# EAGLE design vfd (EAGLE 9.4.2)
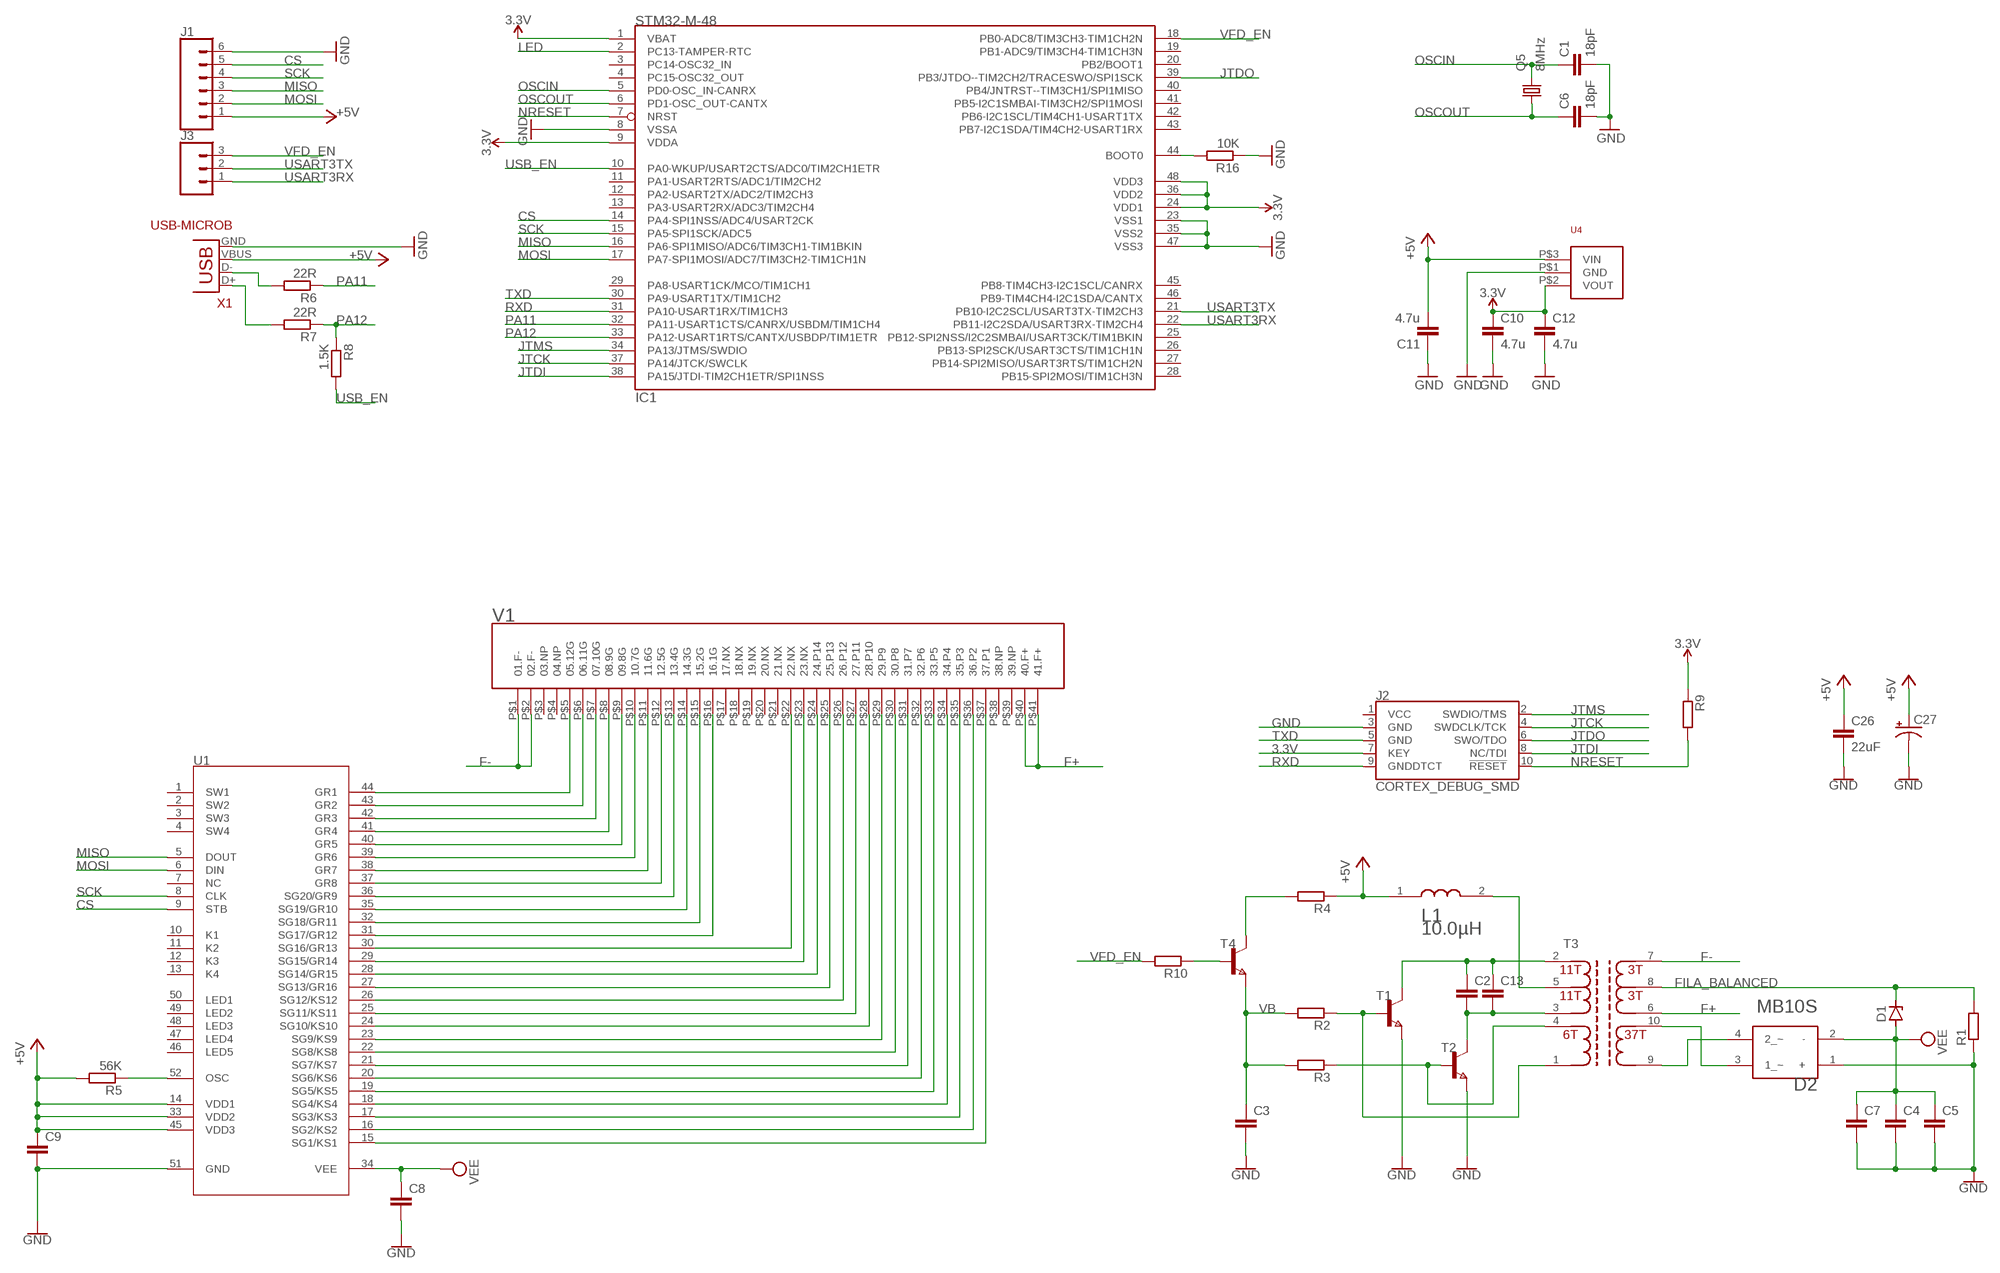
[diagram p0: schematic, sheet 1]

## Parts
C1  18pF  C-EUC0603  [C0603]
C2  C-EUC1206  [C1206]
C3  C-EUC0805  [C0805]
C4  C-EUC0805  [C0805]
C5  C-EUC0805  [C0805]
C6  18pF  C-EUC0603  [C0603]
C7  C-EUC0805  [C0805]
C8  C-EUC0805  [C0805]
C9  C-EUC0805  [C0805]
C10  4.7u  CAP0805  [0805]
C11  4.7u  CAP0805  [0805]
C12  4.7u  CAP0805  [0805]
C13  C-EUC1206  [C1206]
C26  22uF  C-EUC1206  [C1206]
C27  CPOL-US153CLV-0807  [153CLV-0807]
D1  ZENER-DIODESOD80C  [SOD80C]
D2  ON_SEMI_MB10SON_SEMI_MB10S_0_0  [ON_SEMI_MB10S_0]
IC1  STM32-M-48  [LQFP48]
J1  CONN_06NO_SILK_FEMALE_PTH  [1X06_NO_SILK]
J2  CORTEX_DEBUG_SMD  [SAMTECH_FTSH-105-01]
J3  CONN_031X03_NO_SILK  [1X03_NO_SILK]
L1  TDK_SLF7045T-100M1R3-PF  [ASWPA8050]
Q5  8MHz  KX-7  [3.2X2.5_KX-7]
R1  R-EU_R0603  [R0603]
R2  R-EU_R0603  [R0603]
R3  R-EU_R0603  [R0603]
R4  R-EU_R0603  [R0603]
R5  56K  R-EU_R0603  [R0603]
R6  22R  R-EU_R0603  [R0603]
R7  22R  R-EU_R0603  [R0603]
R8  1.5K  R-EU_R0603  [R0603]
R9  R-EU_R0603  [R0603]
R10  R-EU_R0603  [R0603]
R16  10K  R-EU_R0603  [R0603]
T1  NPNSOT23  [SOT-23]
T2  NPNSOT23  [SOT-23]
T3  TRANS_VFD_ER10P5  [ER10P5]
T4  NPNSOT23  [SOT-23]
U1  PT6311B  [QFP52_SOT379-1]
U4  MCP1703SOT-3.3V  MCP1703SOT  [SOT-23A]
V1  VFD_12SS62  [12SS62]
X1  USB-MICROB  [USB-MICROB]

## Nets
3.3V: C10.1 C12.1 IC1.1(VBAT) IC1.9(VDDA) IC1.24(VDD1) IC1.36(VDD2) IC1.48(VDD3) J2.7(KEY) R9.1 U4.P$2(VOUT)
+5V: C9.1 C11.2 C26.1 C27.+ J1.1 L1.1 R4.1 R5.2 U1.14(VDD1) U1.33(VDD2) U1.45(VDD3) U4.P$3(VIN) X1.VBUS
CS: IC1.14(PA4-SPI1NSS/ADC4/USART2CK) J1.5 U1.9(STB)
F+: T3.6 V1.P$40(40.F+) V1.P$41(41.F+)
F-: T3.7 V1.P$1(01.F-) V1.P$2(02.F-)
FILA_BALANCED: D1.C R1.2 T3.8
GND: C1.2 C3.2 C4.2 C5.2 C6.2 C7.2 C8.2 C9.2 C10.2 C11.1 C12.2 C26.2 C27.- D2.1(+) IC1.8(VSSA) IC1.23(VSS1) IC1.35(VSS2) IC1.47(VSS3) J1.6 J2.3(GND) R1.1 R16.1 T1.2(E) T2.2(E) U1.51(GND) U4.P$1(GND) X1.GND
JTCK: IC1.37(PA14/JTCK/SWCLK) J2.4(SWDCLK/TCK)
JTDI: IC1.38(PA15/JTDI-TIM2CH1ETR/SPI1NSS) J2.8(NC/TDI)
JTDO: IC1.39(PB3/JTDO--TIM2CH2/TRACESWO/SPI1SCK) J2.6(SWO/TDO)
JTMS: IC1.34(PA13/JTMS/SWDIO) J2.2(SWDIO/TMS)
LED: IC1.2(PC13-TAMPER-RTC)
MISO: IC1.16(PA6-SPI1MISO/ADC6/TIM3CH1-TIM1BKIN) J1.3 U1.5(DOUT)
MOSI: IC1.17(PA7-SPI1MOSI/ADC7/TIM3CH2-TIM1CH1N) J1.2 U1.6(DIN)
N$5: U1.44(GR1) V1.P$5(05.12G)
N$6: U1.43(GR2) V1.P$6(06.11G)
N$7: U1.42(GR3) V1.P$7(07.10G)
N$8: U1.41(GR4) V1.P$8(08.9G)
N$9: U1.40(GR5) V1.P$9(09.8G)
N$10: U1.39(GR6) V1.P$10(10.7G)
N$11: U1.38(GR7) V1.P$11(11.6G)
N$12: U1.37(GR8) V1.P$12(12.5G)
N$13: U1.36(SG20/GR9) V1.P$13(13.4G)
N$14: U1.35(SG19/GR10) V1.P$14(14.3G)
N$15: U1.32(SG18/GR11) V1.P$15(15.2G)
N$16: U1.31(SG17/GR12) V1.P$16(16.1G)
N$17: U1.15(SG1/KS1) V1.P$37(37.P1)
N$18: U1.16(SG2/KS2) V1.P$36(36.P2)
N$19: U1.17(SG3/KS3) V1.P$35(35.P3)
N$20: U1.18(SG4/KS4) V1.P$34(34.P4)
N$21: U1.19(SG5/KS5) V1.P$33(33.P5)
N$22: U1.20(SG6/KS6) V1.P$32(32.P6)
N$23: U1.21(SG7/KS7) V1.P$31(31.P7)
N$24: U1.22(SG8/KS8) V1.P$30(30.P8)
N$25: U1.23(SG9/KS9) V1.P$29(29.P9)
N$26: U1.24(SG10/KS10) V1.P$28(28.P10)
N$27: U1.25(SG11/KS11) V1.P$27(27.P11)
N$28: U1.26(SG12/KS12) V1.P$26(26.P12)
N$29: U1.27(SG13/GR16) V1.P$25(25.P13)
N$30: U1.28(SG14/GR15) V1.P$24(24.P14)
N$31: U1.29(SG15/GR14) V1.P$23(23.NX)
N$32: U1.30(SG16/GR13) V1.P$22(22.NX)
N$33: R6.2 X1.D-
N$34: R7.2 X1.D+
N$35: R4.2 T4.1(C)
N$36: R10.1 T4.3(B)
N$41: R5.1 U1.52(OSC)
N$43: D2.4(2_~) T3.9
N$44: D2.3(1_~) T3.10
N$46: L1.2 T3.5
N$48: C2.1 C13.1 T1.1(C) T3.2
N$49: C2.2 C13.2 T2.1(C) T3.3
N$52: R3.1 T2.3(B) T3.4
N$53: R2.1 T1.3(B) T3.1
N$273: IC1.44(BOOT0) R16.2
NRESET: IC1.7(NRST) J2.10(!RESET) R9.2
OSCIN: C1.1 IC1.5(PD0-OSC_IN-CANRX) Q5.3
OSCOUT: C6.1 IC1.6(PD1-OSC_OUT-CANTX) Q5.1
PA11: IC1.32(PA11-USART1CTS/CANRX/USBDM/TIM1CH4) R6.1
PA12: IC1.33(PA12-USART1RTS/CANTX/USBDP/TIM1ETR) R7.1 R8.1
RXD: IC1.31(PA10-USART1RX/TIM1CH3) J2.9(GNDDTCT)
SCK: IC1.15(PA5-SPI1SCK/ADC5) J1.4 U1.8(CLK)
TXD: IC1.30(PA9-USART1TX/TIM1CH2) J2.5(GND)
USART3RX: IC1.22(PB11-I2C2SDA/USART3RX-TIM2CH4) J3.1
USART3TX: IC1.21(PB10-I2C2SCL/USART3TX-TIM2CH3) J3.2
USB_EN: IC1.10(PA0-WKUP/USART2CTS/ADC0/TIM2CH1ETR) R8.2
VB: C3.1 R2.2 R3.2 T4.2(E)
VEE: C4.1 C5.1 C7.1 C8.1 D1.A D2.2(-) U1.34(VEE)
VFD_EN: IC1.18(PB0-ADC8/TIM3CH3-TIM1CH2N) J3.3 R10.2
Unconnected: IC1.3(PC14-OSC32_IN) IC1.4(PC15-OSC32_OUT) IC1.11(PA1-USART2RTS/ADC1/TIM2CH2) IC1.12(PA2-USART2TX/ADC2/TIM2CH3) IC1.13(PA3-USART2RX/ADC3/TIM2CH4) IC1.19(PB1-ADC9/TIM3CH4-TIM1CH3N) IC1.20(PB2/BOOT1) IC1.25(PB12-SPI2NSS/I2C2SMBAI/USART3CK/TIM1BKIN) IC1.26(PB13-SPI2SCK/USART3CTS/TIM1CH1N) IC1.27(PB14-SPI2MISO/USART3RTS/TIM1CH2N) IC1.28(PB15-SPI2MOSI/TIM1CH3N) IC1.29(PA8-USART1CK/MCO/TIM1CH1) IC1.40(PB4/JNTRST--TIM3CH1/SPI1MISO) IC1.41(PB5-I2C1SMBAI-TIM3CH2/SPI1MOSI) IC1.42(PB6-I2C1SCL/TIM4CH1-USART1TX) IC1.43(PB7-I2C1SDA/TIM4CH2-USART1RX) IC1.45(PB8-TIM4CH3-I2C1SCL/CANRX) IC1.46(PB9-TIM4CH4-I2C1SDA/CANTX) J2.1(VCC) U1.1(SW1) U1.2(SW2) U1.3(SW3) U1.4(SW4) U1.7(NC) U1.10(K1) U1.11(K2) U1.12(K3) U1.13(K4) U1.46(LED5) U1.47(LED4) U1.48(LED3) U1.49(LED2) U1.50(LED1) V1.P$3(03.NP) V1.P$4(04.NP) V1.P$17(17.NX) V1.P$18(18.NX) V1.P$19(19.NX) V1.P$20(20.NX) V1.P$21(21.NX) V1.P$38(38.NP) V1.P$39(39.NP)

## Library data of the parts
C1 C6 = resistor:C-EU: CAPACITOR, European symbol
C2-C5 C7-C9 C13 = rcl:C-EU: CAPACITOR, European symbol; SPICEPREFIX: C
C10-C12 = SparkFun:CAP: Capacitor Standard 0603 ceramic capacitor, and 0.1" leaded capacitor.
C26 = resistor:C-EU: CAPACITOR, European symbol; HEIGHT: 1.8
C27 = rcl:CPOL-US: POLARIZED CAPACITOR, American symbol; SPICEPREFIX: C
D1 = diode:ZENER-DIODE: Z-Diode
D2 = ON Semi - MB10S:ON_SEMI_MB10S: Diode Rectifier Bridge Single 1KV 0.8A 4-Pin SOIC T/R; CENTROID_NOT_SPECIFIED: No; DATASHEET: http://www.onsemi.com/pub/Collateral/MB10S-D.pdf; DEVICE_CLASS_L1: Discrete Semiconductors; DEVICE_CLASS_L2: Diodes; DEVICE_CLASS_L3: Rectifier Diodes; DIGIKEY_DESCRIPTION: DIODE BRIDGE 0.5A 1000V 4-SOIC; DIGIKEY_PART_NUMBER: MB10SCT-ND; FOOTPRINT_URL: http://www.onsemi.com/pub/Collateral/751EP.PDF; FORWARD_CURRENT: 0.8A; HEIGHT: 2.9mm; LEAD_FREE: yes; MAX_JUNCTION_TEMP: +150°C; MAX_REPETITIVE_REVERSE_VOLTAGE: 1000V; MAX_SURGE_FORWARD_CURRENT: 35A; MF: ON Semi; MFG_PACKAGE_IDENT: 751EP; MFG_PACKAGE_IDENT_DATE: 09/2016; MFG_PACKAGE_IDENT_REV: O; MOUSER_PART_NUMBER: 512-MB10S; MPN: MB10S; PACKAGE: SOIC4; PEAK_REVERSE_CURRENT: 0.5mA; PREFIX: D; REVERSE_VOLTAGE: 1000V; ROHS: yes; STANDOFF_HEIGHT: 0.05mm; TEMPERATURE_RANGE_HIGH: +150°C; TEMPERATURE_RANGE_LOW: -55°C; VERIFICATION_VERSION: 0.0.0.1
IC1 = pel_stm32:STM32-M-48: STM32F103 Medium Density 48pins
J1 = SparkFun-Connectors:CONN_06: Multi connection point. Often used as Generic Header-pin footprint for 0.1 inch spaced/style header connections On any of the 0.1 inch spaced packages, you can populate with these: Break Away Headers - Straight <https://www.sparkfun.com/products/116> (PRT-00116) Break Away Male Headers - Right Angle <https://www.sparkfun.com/products/553> (PRT-00553) Female Headers <https://www.sparkfun.com/products/115> (PRT-00115) Break Away Headers - Machine Pin <https://www.sparkfun.com/products/117> (PRT-00117) Break Away Female Headers - Swiss Machine Pin <https://www.sparkfun.com/products/743> (PRT-00743) Arduino Stackable Header - 6 Pin <https://www.sparkfun.com/products/9280> (PRT-09280) For SCREWTERMINALS and SPRING TERMINALS visit here: Screw Terimnals on SparkFun.com <https://www.sparkfun.com/search/results?term=Screw+Terminals> (5mm/3.5mm/2.54mm spacing) This device is also useful as a general connection point to wire up your design to another part of your project. Our various solder wires solder well into these plated through hole pads. Hook-Up Wire - Assortment (Stranded, 22 AWG) <https://www.sparkfun.com/products/11375> (PRT-11375) Hook-Up Wire - Assortment (Solid Core, 22 AWG) <https://www.sparkfun.com/products/11367> (PRT-11367) View the entire wire category on our website here <https://www.sparkfun.com/categories/141>; PROD_ID: CONN-08437
J2 = SparkFun-Connectors:CORTEX_DEBUG: Cortex Debug Connector - 10 pin Supports JTAG debug, Serial Wire debug, and Serial Wire Viewer. PTH and SMD connector options available. General Connector Information <http://infocenter.arm.com/help/topic/com.arm.doc.faqs/attached/13634/cortex_debug_connectors.pdf> Products: PTH Connector <http://www.digikey.com/product-detail/en/cnc-tech/3220-10-0100-00/1175-1627-ND/3883661> -via Digi-Key SparkFun PSoc <https://www.sparkfun.com/products/13229> SparkFun T <https://www.sparkfun.com/products/13810>
J3 = SparkFun-Connectors:CONN_03: Multi connection point. Often used as Generic Header-pin footprint for 0.1 inch spaced/style header connections On any of the 0.1 inch spaced packages, you can populate with these: Break Away Headers - Straight <https://www.sparkfun.com/products/116> (PRT-00116) Break Away Male Headers - Right Angle <https://www.sparkfun.com/products/553> (PRT-00553) Female Headers <https://www.sparkfun.com/products/115> (PRT-00115) Break Away Headers - Machine Pin <https://www.sparkfun.com/products/117> (PRT-00117) Break Away Female Headers - Swiss Machine Pin <https://www.sparkfun.com/products/743> (PRT-00743) Stackable Header - 3 Pin (Female, 0.1") <https://www.sparkfun.com/products/13875> (PRT-13875) For SCREWTERMINALS and SPRING TERMINALS visit here: Screw Terimnals on SparkFun.com <https://www.sparkfun.com/search/results?term=Screw+Terminals> (5mm/3.5mm/2.54mm spacing) This device is also useful as a general connection point to wire up your design to another part of your project. Our various solder wires solder well into these plated through hole pads. Hook-Up Wire - Assortment (Stranded, 22 AWG) <https://www.sparkfun.com/products/11375> (PRT-11375) Hook-Up Wire - Assortment (Solid Core, 22 AWG) <https://www.sparkfun.com/products/11367> (PRT-11367) View the entire wire category on our website here <https://www.sparkfun.com/categories/141> Special notes: Molex polarized connector foot print use with SKU : PRT-08232 with associated crimp pins and housings.
L1 = TDK - SLF7045T-100M1R3-PF:TDK_SLF7045T-100M1R3-PF: FIXED IND 10UH 1.3A 43.2 MOHM
Q5 = crystal-geyer_V1_0:KX: Quartz Crystals (MHz) SMD: KX - Serie Model Size l/w/h [mm] Frequency Range Frequency Stability Temp. Range [°C] Load Capacitance AECQ 200 availabel Datasheet KX-4 KX-5 KX-6 KX-7 KX-9A KX-9B KX-12A KX-12B KX-13 KX-20 KX-K KX-KS 1.6/1.2/0.3 2.0/1.6/0.45 2.5/2.0/0.55 3.2/2.5/0.8 5.0/3.2/1.0 5.0/3.2/1.1 6.0/3.5/1.1 6.0/3.5/1.0 7.0/5.0 /1.3 11.6/5.5/1.6 12.3/4.5/4.2 12.3/4.5/3.2 24.0 ~ 80.0 MHz 16.0 ~ 80.0 MHz 12.0 ~ 80.0 MHz 8.0 ~ 60.0 MHz 7,68 ~ 300,0 MHz 8,0 ~ 50,0 MHz 8,0 ~ 150,0 MHz 8,0 ~ 50,0 MHz 6,0 ~ 160,0 MHz 3,579 ~ 25,0 MHz 3,579 ~ 70,0 MHz 3,579 ~ 70,0 MHz ±10 … ±50ppm ±10 … ±50ppm ±10 … ±50ppm ±10 … ±50ppm ±10 … ±50ppm ±10 … ±50ppm ±10 … ±50ppm ±10 … ±50ppm ±10 … ±50ppm ±50ppm ±10 … ±50ppm ±10 … ±50ppm (*) -40°C …+85°C (*) -40°C …+125°C (*) -40°C …+125°C (*) -40°C …+125°C (*) -40°C …+105°C (*) -40°C …+105°C (*) -40°C …+125°C (*) -40°C …+105°C (*) -40°C …+105°C (*) -40°C …+105°C (*) -40°C …+85°C (*) -40°C …+85°C 8, 8…16 8, 8…16 10, 8…16 12, 7…20 16, 10…20 16, 10…20 16, 10…20 16, 12…20 16, 12…20 16, 12…20 16, 12…30 16, 12…30 - yes yes yes - - - - - - - - KX-4.pdf <http://www.geyer-electronic.de/uploads/tx_userartikelfrequenz/GEYER-KX-4.pdf> KX-5.pdf <http://www.geyer-electronic.de/uploads/tx_userartikelfrequenz/GEYER-KX-5.pdf> KX-6.pdf <http://www.geyer-electronic.de/uploads/tx_userartikelfrequenz/GEYER-KX-6.pdf> KX-7.pdf <http://www.geyer-electronic.de/uploads/tx_userartikelfrequenz/GEYER-KX-7.pdf> KX-9A.pdf <http://www.geyer-electronic.de/uploads/tx_userartikelfrequenz/GEYER-KX-9A.pdf> KX-9B.pdf <http://www.geyer-electronic.de/uploads/tx_userartikelfrequenz/GEYER-KX-9B.pdf> KX-12A.pdf <http://www.geyer-electronic.de/uploads/tx_userartikelfrequenz/GEYER-KX-12A.pdf> KX-12B.pdf <http://www.geyer-electronic.de/uploads/tx_userartikelfrequenz/GEYER-KX-12B.pdf> KX-13.pdf <http://www.geyer-electronic.de/uploads/tx_userartikelfrequenz/GEYER-KX-13.pdf> KX-20.pdf <http://www.geyer-electronic.de/uploads/tx_userartikelfrequenz/GEYER-KX-20.pdf> KX-K.pdf <http://www.geyer-electronic.de/uploads/tx_userartikelfrequenz/GEYER-KX-K.pdf> KX-KS.pdf <http://www.geyer-electronic.de/uploads/tx_userartikelfrequenz/GEYER-KX-KS.pdf> <http://www.geyer-electronic.de/fileadmin/template/img/logo-geyer-electronic.png> Details see: http://www.geyer-electronic.de/Frequenz-Produkte.9.0.html Created 2016-06-07, Hans Locher 2016 (C) Geyer Quartz Technology KX4,KX5,KX6,KX7,KX9A,KX9B,KX12A,KX12B,KX13,KX20,KXK,KXKS;1612;2016;2520;3225;5032;6035;7050;11655;12345;1,6x1,2;2,0x1,6;2,5x2,0;3,2x2,5;5,0x3,2;6,0x3,5;7,0x5,0;11,6x5,5;12,3x4,5;12,3x4,5;1.6x1.2;2.0x1.6;2.5x2.0;3.2x2.5;5.0x3.2;6.0x3.5;7.0x5.0;11.6x5.5;12.3x4.5;12.3x4.5;
R1-R5 R9 R10 = rcl:R-EU_: RESISTOR, European symbol; SPICEPREFIX: R
R6-R8 R16 = resistor:R-EU_: RESISTOR, European symbol
T1 T2 T4 = zetex:NPNSOT23: NPN TRANSISTOR; MPN: DSS20201L-7; OC_FARNELL: 1710688; OC_NEWARK: 25R4555
T3 = vfd:TRANS_VFD_ER10P5
U1 = vfd:PT6311B
U4 = icedrink:MCP1703
V1 = vfd:VFD_12SS62
X1 = icedrink:USB: USB Connectors USB-B-PTH is fully proven SKU : PRT-00139 USB-miniB is fully proven SKU : PRT-00587 USB-A-PCB is untested. USB-A-H is throughly reviewed, but untested. Spark Fun Electronics SKU : PRT-00437 USB-B-SMT is throughly reviewed, but untested. Needs silkscreen touching up. USB-A-S has not been used/tested USB-MB-H has not been used/tested

## Net classes
0 default: clearance 0.205 mm

## Board
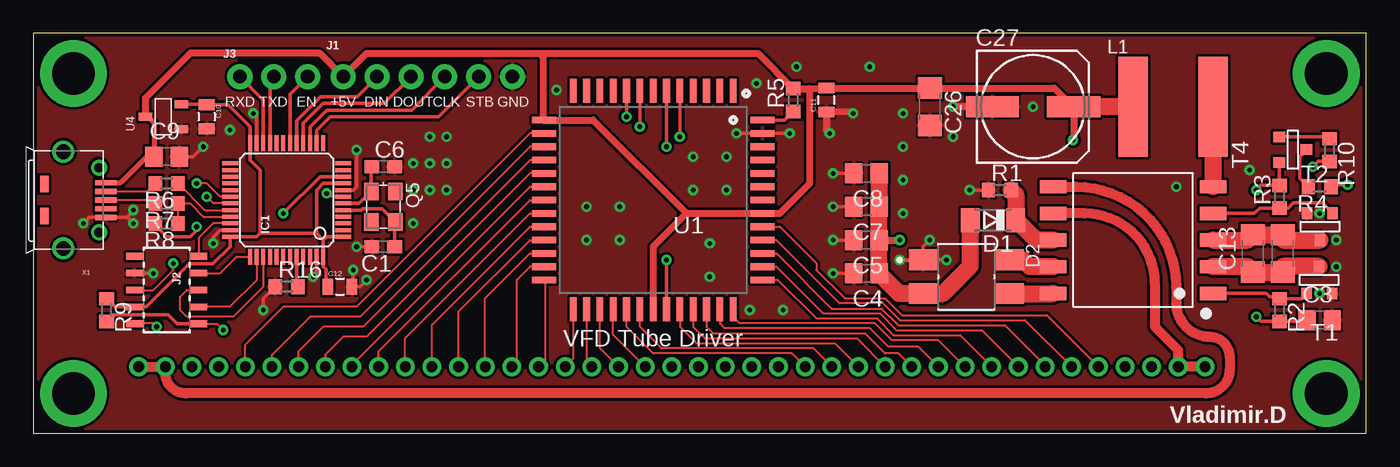
[diagram p1: board, top side]
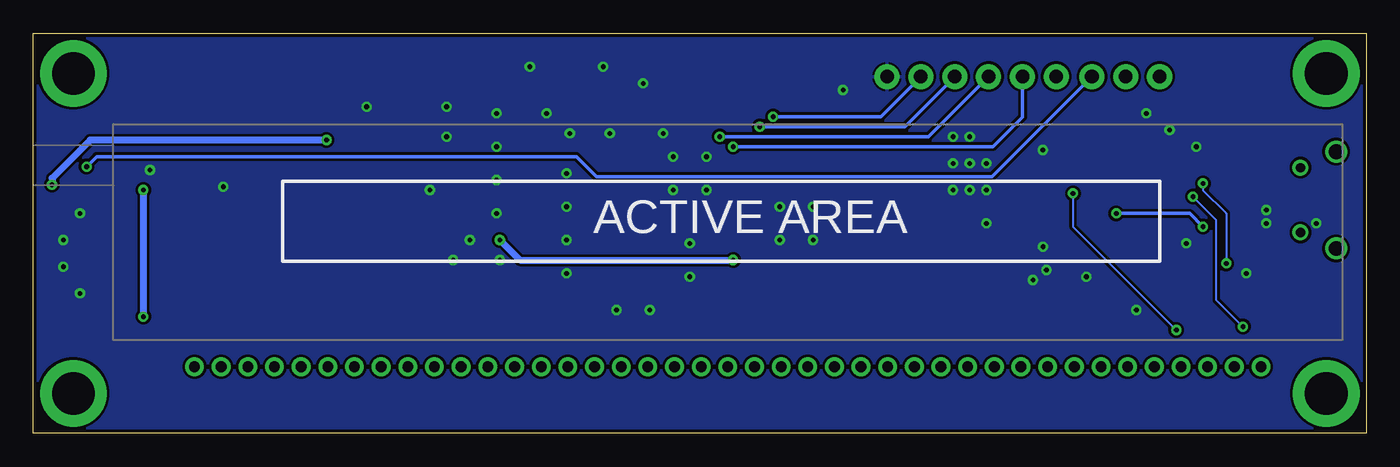
[diagram p2: board, bottom side, seen from below]

Size 100 x 30 mm. Coordinates in mm from the lower left corner, seen from the top.
Outline: 0,0 100,0 100,30 0,30 0,0
Copper layers (1*16): Top 0.035mm / dielectric 1.5mm / Bottom 0.035mm
Design rules "default *": minimum track width 6mil, minimum drill 0.35mm, track to track 5mil, track to pad 5mil, pad to pad 5mil, via to via 5mil, smd to smd 5mil, copper to edge 10mil, drill to drill 6mil, minimum pad ring 10mil, minimum via ring 8mil, stop-mask expansion 4mil, vias tented up to drill 40mil, thermal gap 6mil

### Footprints (pad centres in the part's own frame; a part is rotated, then mirrored left to right if it is on the bottom)
C0603 = smd 1.1 x 1: 1 -0.85,0; 2 0.85,0
C1206 = smd 1.6 x 1.8: 1 -1.4,0; 2 1.4,0
C0805 = smd 1.3 x 1.5: 1 -0.95,0; 2 0.95,0
0805 = smd 0.8 x 1.2: 1 -0.9,0; 2 0.9,0
153CLV-0807 = smd 4 x 1.6: + 3.05,0; - -3.05,0
SOD80C = smd 1.4 x 1.8: A 1.7,0; C -1.7,0
ON_SEMI_MB10S_0 = smd 1.55 x 2.1: 1 -1.27,-3.25; 2 1.27,-3.25; 3 1.27,3.25; 4 -1.27,3.25
LQFP48 = smd 0.3 x 1.2: 1 -2.75,-4.25; 2 -2.25,-4.25; 3 -1.75,-4.25; 4 -1.25,-4.25; 5 -0.75,-4.25; 6 -0.25,-4.25; 7 0.25,-4.25; 8 0.75,-4.25; 9 1.25,-4.25; 10 1.75,-4.25; 11 2.25,-4.25; 12 2.75,-4.25; 25 2.75,4.25; 26 2.25,4.25; 27 1.75,4.25; 28 1.25,4.25; 29 0.75,4.25; 30 0.25,4.25; 31 -0.25,4.25; 32 -0.75,4.25; 33 -1.25,4.25; 34 -1.75,4.25; 35 -2.25,4.25; 36 -2.75,4.25 | smd 1.2 x 0.3: 13 4.25,-2.75; 14 4.25,-2.25; 15 4.25,-1.75; 16 4.25,-1.25; 17 4.25,-0.75; 18 4.25,-0.25; 19 4.25,0.25; 20 4.25,0.75; 21 4.25,1.25; 22 4.25,1.75; 23 4.25,2.25; 24 4.25,2.75; 37 -4.25,2.75; 38 -4.25,2.25; 39 -4.25,1.75; 40 -4.25,1.25; 41 -4.25,0.75; 42 -4.25,0.25; 43 -4.25,-0.25; 44 -4.25,-0.75; 45 -4.25,-1.25; 46 -4.25,-1.75; 47 -4.25,-2.25; 48 -4.25,-2.75
1X06_NO_SILK = drill 1.016 pad 1.88: 1 0,0; 2 2.54,0; 3 5.08,0; 4 7.62,0; 5 10.16,0; 6 12.7,0
SAMTECH_FTSH-105-01 = smd 0.508 x 1.27: 1 -2.54,-2.413; 2 -2.54,2.413; 3 -1.27,-2.413; 4 -1.27,2.413; 5 0,-2.413; 6 0,2.413; 7 1.27,-2.413; 8 1.27,2.413; 9 2.54,-2.413; 10 2.54,2.413
1X03_NO_SILK = drill 1.016 pad 1.88: 1 0,0; 2 2.54,0; 3 5.08,0
ASWPA8050 = smd 2.2 x 7.5: 1 -3,0; 2 3,0
3.2X2.5_KX-7 = smd 1.3 x 1.1: 1 -1.15,-0.9; 2 1.15,-0.9; 3 1.15,0.9; 4 -1.15,0.9
R0603 = smd 1 x 1.1: 1 -0.85,0; 2 0.85,0
SOT-23 = smd 0.787 x 0.889: 1 0.025,-1.016; 2 -0.94,1.016; 3 0.991,1.016
ER10P5 = smd 1 x 2: 1 1,-1.5; 2 3,-1.5; 3 5,-1.5; 4 7,-1.5; 5 9,-1.5; 6 9,10.5; 7 7,10.5; 8 5,10.5; 9 3,10.5; 10 1,10.5
QFP52_SOT379-1 = smd 0.5 x 1.8: 1 -6,-8.2; 2 -5,-8.2; 3 -4,-8.2; 4 -3,-8.2; 5 -2,-8.2; 6 -1,-8.2; 7 0,-8.2; 8 1,-8.2; 9 2,-8.2; 10 3,-8.2; 11 4,-8.2; 12 5,-8.2; 13 6,-8.2; 27 6,8.2; 28 5,8.2; 29 4,8.2; 30 3,8.2; 31 2,8.2; 32 1,8.2; 33 0,8.2; 34 -1,8.2; 35 -2,8.2; 36 -3,8.2; 37 -4,8.2; 38 -5,8.2; 39 -6,8.2 | smd 1.8 x 0.5: 14 8.2,-6; 15 8.2,-5; 16 8.2,-4; 17 8.2,-3; 18 8.2,-2; 19 8.2,-1; 20 8.2,0; 21 8.2,1; 22 8.2,2; 23 8.2,3; 24 8.2,4; 25 8.2,5; 26 8.2,6; 40 -8.2,6; 41 -8.2,5; 42 -8.2,4; 43 -8.2,3; 44 -8.2,2; 45 -8.2,1; 46 -8.2,0; 47 -8.2,-1; 48 -8.2,-2; 49 -8.2,-3; 50 -8.2,-4; 51 -8.2,-5; 52 -8.2,-6
SOT-23A = smd 0.6 x 1: P$1 -0.95,-1.35; P$2 0.95,-1.35; P$3 0,1.35
12SS62 = drill 0.8 pad 1.4: P$1 6.1,-2; P$2 8.1,-2; P$3 10.1,-2; P$4 12.1,-2; P$5 14.1,-2; P$6 16.1,-2; P$7 18.1,-2; P$8 20.1,-2; P$9 22.1,-2; P$10 24.1,-2; P$11 26.1,-2; P$12 28.1,-2; P$13 30.1,-2; P$14 32.1,-2; P$15 34.1,-2; P$16 36.1,-2; P$17 38.1,-2; P$18 40.1,-2; P$19 42.1,-2; P$20 44.1,-2; P$21 46.1,-2; P$22 48.1,-2; P$23 50.1,-2; P$24 52.1,-2; P$25 54.1,-2; P$26 56.1,-2; P$27 58.1,-2; P$28 60.1,-2; P$29 62.1,-2; P$30 64.1,-2; P$31 66.1,-2; P$32 68.1,-2; P$33 70.1,-2; P$34 72.1,-2; P$35 74.1,-2; P$36 76.1,-2; P$37 78.1,-2; P$38 80.1,-2; P$39 82.1,-2; P$40 84.1,-2; P$41 86.1,-2
USB-MICROB = smd 0.4 x 1.6: D+ 0,-3.2; D- 0.65,-3.2; GND -1.3,-3.2; ID -0.65,-3.2; VBUS 1.3,-3.2 | drill 1.1: P$1 -3.625,0; P$2 3.625,0 | drill 0.7: P$3 -2.425,-2.68; P$4 2.425,-2.68 | smd 1.27 x 0.635: P$5 -1.2,1.4; P$6 1.2,1.4

### Placement (x,y rotation side)
C1  26.25,14 180 top
C2  93.75,13.5 90 top
C3  96.5,8.5 0 top
C4  62.5,12 180 top
C5  62.5,14.5 180 top
C6  26.25,20 0 top
C7  62.5,17 180 top
C8  62.5,19.5 180 top
C9  10,20.75 0 top
C10  13,23.75 270 top
C11  59.5,25 90 top
C12  23,11 0 top
C13  91.5,13.5 90 top
C26  67.25,24.5 270 top
C27  75,24.5 0 top
D1  72,16 180 top
D2  70,11.75 270 top
IC1  19,17.5 90 top
J1  23.25,26.75 0 top
J2  10,10.75 270 top
J3  15.5,26.75 0 top
L1  85.5,24.5 0 top
Q5  26.25,17 270 top
R1  72.5,18.25 0 top
R2  93.5,9.25 270 top
R3  93.5,17.75 90 top
R4  96.5,18.5 180 top
R5  57,25 90 top
R6  10,18.75 180 top
R7  10,17.25 180 top
R8  10,15.75 180 top
R9  5.5,9.25 270 top
R10  97.25,21.25 270 top
R16  19,11 0 top
T1  96.5,11.5 180 top
T2  96.5,15.5 0 top
T3  87,9.5 90 top
T4  94.5,21.25 90 top
U1  46.5,17.5 180 top
U4  9.75,23.75 90 top
V1  94,7 0 bottom
X1  2.25,17.5 90 top

### Tracks (layer width: path | path; a pad name or v marks a point on that pad's centre or on a via)
3.3V
  Top 0.254: 17,15 17,19.75 16.25,20.5 IC1.24 16.25,23 14.6,24.65 C10.1 12.95,24.7 U4.P$2 | 17,15 16.75,14.75 IC1.36 14.75,14 13.45,12.7 11.7,12.7 8.48,9.48 J2.7 6.12,9.48 R9.1 | 21.75,14.5 IC1.48 21.75,12.5 21.96,12.29 21.96,11.14 C12.1 | 21.75,14.5 22,14.75 IC1.1 | 21.75,14.5 21.25,15 | 21.25,15 17,15 | IC1.9 21.75,18.75 21.25,18.25 21.25,15
+5V  (via drill 0.35)
  Top 0.254: v98.6,18.65 97.5,18.65 R4.1 | 78.05,22.05 v78,22
  Top 0.381: X1.VBUS 6.55,18.8 8.5,20.75 C9.1 9.05,23.25 8.55,23.75 U4.P$3
  Top 0.508: U4.P$3 8.4,25.15 11.75,28.5 21.5,28.5 J1.1 25,28.5 38,28.5 | C26.1 67.3,25.85 | 59.75,25.9 59.74,25.9 C11.2 | C26.1 76.6,25.9 78,24.5 | 58.25,25.85 R5.2 54.35,28.5 38,28.5 | 38,28.5 38.25,28.25 38.25,23.5 U1.14 42,23.5 49,16.5 | 49,16.5 U1.45 56,16.5 58.25,18.75 58.25,25.85 | 49,16.5 46.5,14 U1.33 | 58.25,25.85 C11.2 | C27.+ 78.05,22.05 | C11.2 C26.1
  Top 1.27: L1.1 C27.+ 78,24.5
  Bottom 0.508: v98.6,18.65 98.6,19.15 95.75,22 v78,22
CS  (via drill 0.35)
  Top 0.254: IC1.14 21.25,22.75 22.25,23.75 30.41,23.75 J1.5 | v44.5,23.75 U1.9
  Bottom 0.254: J1.5 36.41,23.75 v44.5,23.75
F+
  Top 0.254: V1.P$41 7.75,5
  Top 0.762: T3.6 78.21,18.5 arc-90 85.75,10.96 85.75,9.75 arc90 88.25,7.25 arc-90 89.75,5.75 89.75,4.75 arc-90 88,3 11.44,3 arc-90 9.9,4.54 V1.P$40 7.75,5
F-
  Top 0.762: V1.P$1 V1.P$2 | 85.75,5 V1.P$2 | V1.P$2 85.9,6.25 84.15,8 84.15,11.21 arc90 78.86,16.5 T3.7
FILA_BALANCED
  Top 1.27: T3.8 75.25,14.5 73.75,16 D1.C 73.7,17.9 R1.2
GND  (via drill 0.35)
  Top 0.254: R16.1 17.25,10.1 v17.25,9.25 | IC1.35 14.73,15.23 14.01,15.23 13.5,14.72 v13.5,14.25 | J2.3 8.98,12.02 v9,12 | v3.75,15.75 4.2,16.2 X1.GND 7.05,16.2 | 7.05,16.2 v7.5,15.75 | 7.05,16.2 7.5,16.65 v7.5,16.75 | v12.75,21.5 12,20.75 C9.2 | IC1.23 16.75,23.75 v16.5,24 | v24.25,21.25 24.25,18.5 24,18.25 IC1.8 | IC1.47 21.25,12 v21,11.75 | C1.2 v24.25,14 | C8.2 v60,19.5 | C7.2 v60,17 | C4.2 v60,12 | R1.1 v70.25,18.25 | v67.25,14.5 66.75,14 D2.1 | D2.1 66.73,13 v65,13 | D2.1 68.48,13.02 v68.5,13 | C5.2 v60,14.5 | v52.75,22.5 U1.51 v56.75,22.5 | v25,11.5 24.5,11 C12.2 24,11.07 v24,12.25
  Top 0.508: C27.- v69,24.5 | v59.75,22.5 59.5,22.75 C11.1 61.35,24.15 v61.5,24
  other vias: 14.75,22.75 28.5,20.25 65.25,24 65.25,21.5 65.25,16.5 65.25,19 69,22.25 75,24.5 91.25,19.75 85.75,18.5 39.25,25.75 54.25,26.25 57.25,27.5 62.75,27.5 49.5,18.25 52,18.25 52,20.75 49.5,20.75 96.5,10.5 97.75,12.5 96.5,16.5 97.75,14.5 28.5,18.25 28.5,15.75 41.5,14.5 44,14.5 44,17 41.5,17 29.75,20.25 31,20.25 31,22.25 29.75,22.25 29.75,18.25 31,18.25 50.75,11.75 50.75,14.25 56.25,9.25 53.75,9.25
  pour Top: -5,35 105,35 105,-5 -5,-5
  pour Bottom: -10,40 110,40 110,-10 -10,-10
JTCK
  Top 0.152: J2.4 14.02,12.02 15.25,13.25 IC1.37
JTDI
  Top 0.152: IC1.38 16.75,11.5 14.73,9.48 J2.8
JTDO
  Top 0.152: IC1.39 17.25,11 15,8.75 11.5,8.75 11,9.25 11,10.25 11.5,10.75 J2.6
JTMS
  Top 0.152: IC1.34 13.5,15.75 12.41,14.66 J2.2
MISO  (via drill 0.35)
  Top 0.254: IC1.16 20.25,23.25 21.75,24.75 26.33,24.75 J1.3 | U1.5 v48.5,22.25
  Bottom 0.254: J1.3 32.83,22.25 v48.5,22.25
MOSI  (via drill 0.35)
  Top 0.254: J1.2 24.29,25.25 21.54,25.25 19.75,23.46 IC1.17 | v47.5,21.5 U1.6
  Bottom 0.254: J1.2 25.79,23.71 28,21.5 v47.5,21.5
N$1  (via drill 3.2 pad 5)
  other vias: 3,27
N$2  (via drill 3.2 pad 5)
  other vias: 3,3
N$3  (via drill 3.2 pad 5)
  other vias: 97,27
N$4  (via drill 3.2 pad 5)
  other vias: 97,3
N$5
  Top 0.152: V1.P$5 76.04,8.86 65.16,8.86 63.89,10.12 60.88,10.12 58.75,12.25 58.75,12.75 56,15.5 U1.44
N$6
  Top 0.152: V1.P$6 74.4,8.5 65.01,8.5 63.76,9.75 60.5,9.75 55.75,14.5 U1.43
N$7
  Top 0.152: V1.P$7 76,5 72.89,8.11 64.9,8.11 63.65,9.36 59.89,9.36 55.75,13.5 U1.42
N$8
  Top 0.152: V1.P$8 71.15,7.75 64.75,7.75 63.5,9 59.25,9 55.75,12.5 U1.41
N$9
  Top 0.152: V1.P$9 69.54,7.36 64.55,7.36 63.28,8.63 58.75,8.63 55.88,11.5 U1.40
N$10
  Top 0.152: V1.P$10 67.9,7 64.4,7 63.13,8.27 52.98,8.27 52.5,8.75 U1.39
N$11
  Top 0.152: V1.P$11 66.4,6.5 64.15,6.5 62.74,7.91 51.84,7.91 51.5,8.25 U1.38
N$12
  Top 0.152: V1.P$12 64.9,6 63.9,6 62.41,7.49 51.01,7.49 50.5,8 U1.37
N$13
  Top 0.152: V1.P$13 61.78,7.12 50.38,7.12 49.5,8 U1.36
N$14
  Top 0.152: V1.P$14 60.16,6.74 49.76,6.74 48.5,8 U1.35
N$15
  Top 0.152: V1.P$15 58.53,6.37 47.13,6.37 45.5,8 U1.32
N$16
  Top 0.152: V1.P$16 56.9,6 46.5,6 44.5,8 U1.31
N$17
  Top 0.152: V1.P$37 15.9,6.65 18.75,9.5 24.25,9.5 37.25,22.5 U1.15
N$18
  Top 0.152: V1.P$36 17.9,5.9 20.75,8.75 24.5,8.75 37.25,21.5 U1.16
N$19
  Top 0.152: V1.P$35 19.9,6.15 21.75,8 24.75,8 37.25,20.5 U1.17
N$20
  Top 0.152: V1.P$34 21.9,5.9 23.25,7.25 25,7.25 37.26,19.5 U1.18
N$21
  Top 0.152: V1.P$33 23.9,5.15 37.25,18.5 U1.19
N$22
  Top 0.152: V1.P$32 25.9,6.15 37.25,17.5 U1.20
N$23
  Top 0.152: V1.P$31 27.9,7.15 37.25,16.5 U1.21
N$24
  Top 0.152: V1.P$30 29.9,8.15 37.25,15.5 U1.22
N$25
  Top 0.152: V1.P$29 31.9,9.15 37.25,14.5 U1.23
N$26
  Top 0.152: V1.P$28 33.9,10.15 37.25,13.5 U1.24
N$27
  Top 0.152: U1.25 37.25,12.5 36.25,11.5 36.25,5.35 V1.P$27
N$28
  Top 0.152: V1.P$26 38.4,5.5 38.4,11.5 U1.26
N$29
  Top 0.152: U1.27 40.5,5.6 V1.P$25
N$30
  Top 0.152: U1.28 41.5,5.4 V1.P$24
N$31
  Top 0.152: V1.P$23 42.5,6.4 U1.29
N$32
  Top 0.152: V1.P$22 43.5,7.4 U1.30
N$33
  Top 0.152: X1.D- 8.55,18.15 R6.2
N$34
  Top 0.152: R7.2 8.9,17.5 X1.D+
N$35
  Top 0.254: T4.1 95,20.76 95,19.15 R4.2
N$36
  Top 0.254: T4.3 97.11,22.24 R10.1
N$41
  Top 0.254: R5.1 56.35,23.5 U1.52
N$43
  Top 1.27: T3.9 74.75,12.5 74.23,13.02 D2.4
N$44
  Top 1.27: D2.3 76.48,10.48 T3.10
N$46
  Top 1.27: L1.2 T3.5
N$48
  Top 0.254: C2.1 93.35,12.1
  Top 1.27: T1.1 93.77,12.52 93.35,12.1 C13.1 91.1,12.5 T3.2
N$49
  Top 1.27: C2.2 93.78,14.48 T2.1 | T3.3 91.1,14.5 C13.2 C2.2 | C2.2 93.85,14.9 94,14.75 93.9,14.75 C2.2
N$52
  Top 0.254: T2.3 96.71,17.29 94.54,17.29 94.15,16.9 R3.1 92,16.9 91.6,16.5 T3.4
N$53
  Top 0.254: T3.1 92.5,10.5 92.75,10.25 93.35,10.25 R2.1 95.12,10.1 T1.3
N$273
  Top 0.254: IC1.44 19.75,11.1 R16.2
NRESET  (via drill 0.35)
  Top 0.152: J2.10 13.79,8.21 v14.25,7.75 | IC1.7 22.25,17.75 v22,18
  Top 0.254: R9.2 5.99,8.89 8.36,8.89 8.37,8.9 10.1,8.9 10.79,8.21 J2.10
  Bottom 0.152: v22,18 22,15.5 v14.25,7.75
OSCIN
  Top 0.254: IC1.5 24.58,16.75 24.66,16.83 26.17,16.83 Q5.3 27.1,15.8 C1.1
OSCOUT
  Top 0.254: IC1.6 24.43,17.25 25.33,18.15 Q5.1 25.35,19.95 C6.1
PA11
  Top 0.152: R6.1 12.85,16.75 IC1.32
PA12
  Top 0.152: IC1.33 12.75,16.25 11.75,17.25 R7.1 R8.1
RXD  (via drill 0.35)
  Top 0.152: IC1.31 13.5,17.25 v13,17.75 | v9.25,8 9,8.25 7.63,8.25 J2.9
  Bottom 0.152: v13,17.75 11.25,16 11.25,10 v9.25,8
SCK  (via drill 0.35)
  Top 0.254: IC1.15 20.75,23 22,24.25 28.37,24.25 J1.4 | U1.8 v45.5,23
  Bottom 0.254: J1.4 34.62,23 v45.5,23
TXD  (via drill 0.35)
  Top 0.152: IC1.30 14,17.75 13,18.75 v12.25,18.75 | J2.5 9,10.75 10.5,12.25 v10.5,12.75
  Bottom 0.152: v12.25,18.75 12.25,18.25 10.5,16.5 v10.5,12.75
USART3RX
  Top 0.254: J3.1 17.25,25 IC1.22
USART3TX
  Top 0.254: J3.2 17.75,26.46 IC1.21
USB_EN  (via drill 0.35)
  Top 0.254: IC1.10 21.5,19.25 v18.75,16.5 | v12.25,15.5 12.25,15.25 11.75,14.75 10,14.75 9.15,15.6 R8.2
  Bottom 0.254: v18.75,16.5 13.25,16.5 v12.25,15.5
VB  (via drill 0.35)
  Top 0.254: C3.1 95.45,8.4 R2.2 92.1,8.4 v91.75,8.75 | v91.75,18.25 92.1,18.6 R3.2 93.48,18.62 T4.2
  Bottom 0.508: v91.75,18.25 v91.75,8.75
VEE  (via drill 0.35)
  Top 0.254: U1.34 v47.5,13
  Top 0.508: C5.1 v65,14.5
  Top 1.27: D1.A 70.3,12.55 68.23,10.48 D2.2 64.97,10.48 C4.1 C5.1 C7.1 C8.1
  Bottom 0.508: v65,14.5 63.5,13 v47.5,13
VFD_EN  (via drill 0.35)
  Top 0.254: v96,20 96.4,20.4 R10.2 | IC1.18 19.25,25.42 J3.3
  Bottom 0.254: J3.3 28.08,19.25 57.75,19.25 59.25,20.75 95.25,20.75 v96,20

### Text on the board
tPlace: RXD | TXD | EN | +5V | DIN | DOUT | CLK | STB | GND | VFD Tube Driver | Vladimir.D